# EAGLE design kanal_v2 (EAGLE 6.3)
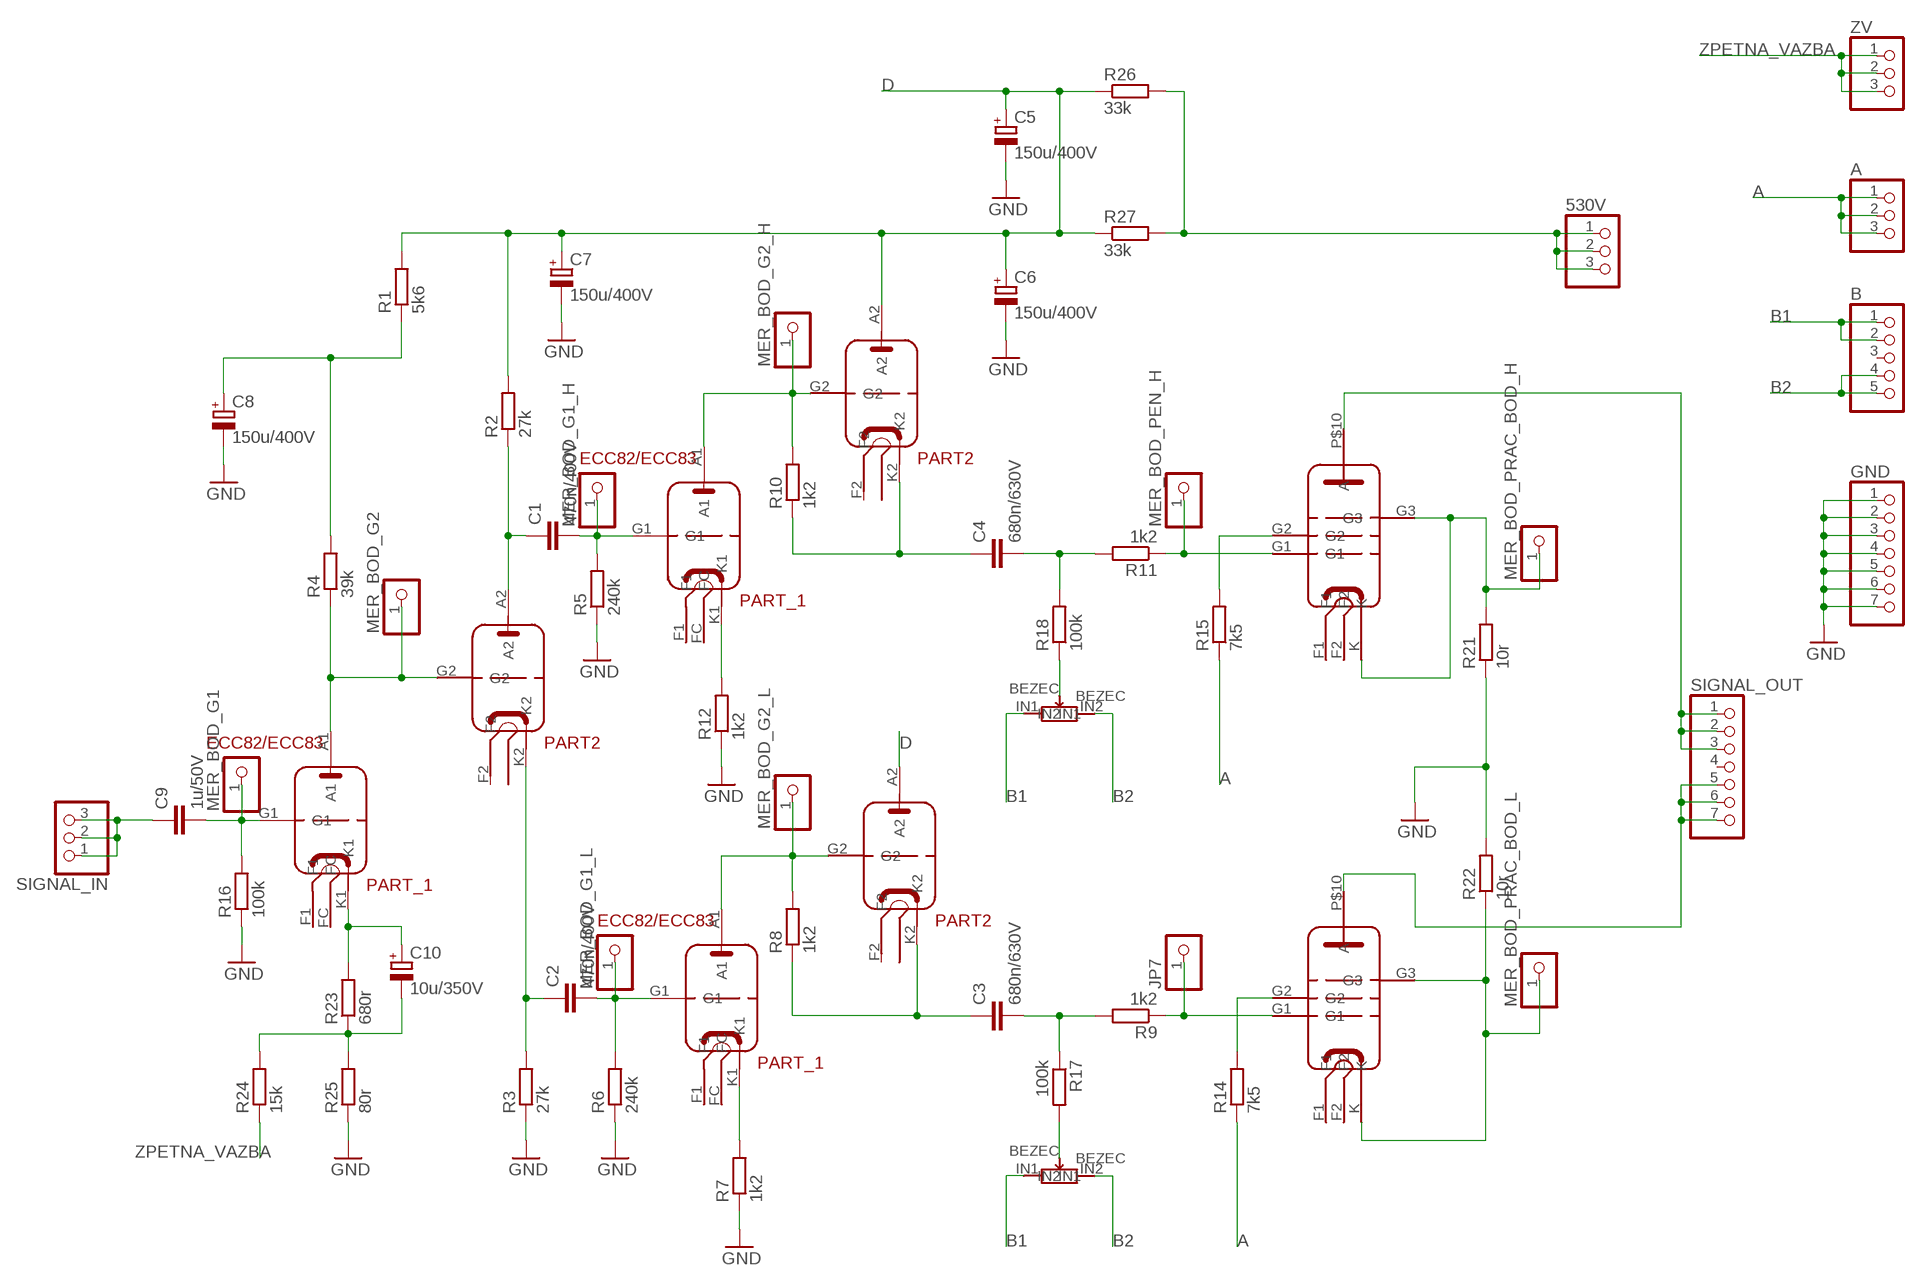
[diagram p0: schematic, sheet 1]

## Parts
530V  PINHD-1X3  [1X03]
A  PINHD-1X3  [1X03]
B  PINHD-1X5  [1X05]
C1  470n/400V  C15/7  [C15B7]
C2  470n/400V  C15/7  [C15B7]
C3  680n/630V  C27/11  [C27.5B11]
C4  680n/630V  C27/11  [C27.5B11]
C5  150u/400V  CPOL-EUE10-25  [EB25D]
C6  150u/400V  CPOL-EUE10-25  [EB25D]
C7  150u/400V  CPOL-EUE10-25  [EB25D]
C8  150u/400V  CPOL-EUE10-25  [EB25D]
C9  1u/50V  C5/3.5  [C5B3.5]
C10  10u/350V  CPOL-EUE5-10.5  [E5-10,5]
GND  PINHD-1X7  [1X07]
JP7  PINHD-1X1  [1X01]
MER_BOD_G1  PINHD-1X1  [1X01]
MER_BOD_G1_H  PINHD-1X1  [1X01]
MER_BOD_G1_L  PINHD-1X1  [1X01]
MER_BOD_G2  PINHD-1X1  [1X01]
MER_BOD_G2_H  PINHD-1X1  [1X01]
MER_BOD_G2_L  PINHD-1X1  [1X01]
MER_BOD_PEN_H  PINHD-1X1  [1X01]
MER_BOD_PRAC_BOD_H  PINHD-1X1  [1X01]
MER_BOD_PRAC_BOD_L  PINHD-1X1  [1X01]
R1  5k6  R-EU_0309/10  [0309/10]
R2  27k  R-EU_0309/10  [0309/10]
R3  27k  R-EU_0309/10  [0309/10]
R4  39k  R-EU_0309/10  [0309/10]
R5  240k  R-EU_0309/10  [0309/10]
R6  240k  R-EU_0309/10  [0309/10]
R7  1k2  R-EU_0309/10  [0309/10]
R8  1k2  R-EU_0309/10  [0309/10]
R9  1k2  R-EU_0309/10  [0309/10]
R10  1k2  R-EU_0309/10  [0309/10]
R11  1k2  R-EU_0309/10  [0309/10]
R12  1k2  R-EU_0309/10  [0309/10]
R14  7k5  R-EU_0309/10  [0309/10]
R15  7k5  R-EU_0309/10  [0309/10]
R16  100k  R-EU_0309/10  [0309/10]
R17  100k  R-EU_0309/10  [0309/10]
R18  100k  R-EU_0309/10  [0309/10]
R21  10r  R-EU_0309/10  [0309/10]
R22  10r  R-EU_0309/10  [0309/10]
R23  680r  R-EU_0309/10  [0309/10]
R24  15k  R-EU_0309/10  [0309/10]
R25  80r  R-EU_0309/10  [0309/10]
R26  33k  R-EU_0309/10  [0309/10]
R27  33k  R-EU_0309/10  [0309/10]
SIGNAL_IN  PINHD-1X3  [1X03]
SIGNAL_OUT  PINHD-1X7  [1X07]
U$1  ECC82  [ECC82_PACKAGE]
U$2  ECC83  [ECC82_PACKAGE]
U$3  ECC83  [ECC82_PACKAGE]
U$4  PL509  [PL509_PACKAGE]
U$5  PL509  [PL509_PACKAGE]
U$6  TRIMMER  [TRIMMER_15X15_PACKAGE]
U$7  TRIMMER  [TRIMMER_15X15_PACKAGE]
ZV  PINHD-1X3  [1X03]

## Nets
A: A.1 A.2 A.3 R14.1 R15.1
B1: B.1 B.2 U$6.IN1 U$7.IN1
B2: B.4 B.5 U$6.IN2 U$7.IN2
D: C5.+ C6.+ C7.+ R1.2 R2.2 R26.1 R27.1 U$2.A2 U$3.A2
GND: C5.- C6.- C7.- C8.- GND.1 GND.2 GND.3 GND.4 GND.5 GND.6 GND.7 R3.1 R5.1 R6.1 R7.1 R12.1 R16.1 R21.1 R22.2 R25.1
MER_BOD_PEN_L: JP7.1 R9.1 U$5.G1
N$1: C9.2 MER_BOD_G1.1 R16.2 U$1.G1
N$2: C10.+ R23.2 U$1.K1
N$3: C10.- R23.1 R24.2 R25.2
N$4: MER_BOD_G2.1 R4.1 U$1.A1 U$1.G2
N$5: C8.+ R1.1 R4.2
N$6: C1.1 R2.1 U$1.A2
N$8: C2.1 R3.2 U$1.K2
N$9: C1.2 MER_BOD_G1_H.1 R5.2 U$2.G1
N$10: C2.2 MER_BOD_G1_L.1 R6.2 U$3.G1
N$11: R17.2 U$6.BEZEC
N$12: R7.2 U$3.K1
N$13: MER_BOD_G2_L.1 R8.2 U$3.A1 U$3.G2
N$14: C3.1 R8.1 U$3.K2
N$15: C3.2 R9.2 R17.1
N$17: R14.2 U$5.G2
N$18: C4.1 R10.1 U$2.K2
N$19: MER_BOD_PRAC_BOD_L.1 R22.1 U$5.G3 U$5.K
N$20: MER_BOD_PRAC_BOD_H.1 R21.2 U$4.G3 U$4.K
N$21: MER_BOD_G2_H.1 R10.2 U$2.A1 U$2.G2
N$22: SIGNAL_OUT.5 SIGNAL_OUT.6 SIGNAL_OUT.7 U$5.P$10(A)
N$23: 530V.1 530V.2 530V.3 R26.2 R27.2
N$24: C4.2 R11.2 R18.2
N$25: MER_BOD_PEN_H.1 R11.1 U$4.G1
N$26: R18.1 U$7.BEZEC
N$27: R12.2 U$2.K1
N$28: C9.1 SIGNAL_IN.1 SIGNAL_IN.2 SIGNAL_IN.3
N$29: R15.2 U$4.G2
N$30: SIGNAL_OUT.1 SIGNAL_OUT.2 SIGNAL_OUT.3 U$4.P$10(A)
ZPETNA_VAZBA: R24.1 ZV.1 ZV.2 ZV.3
Unconnected: B.3 SIGNAL_OUT.4 U$1.F1 U$1.F2 U$1.FC U$2.F1 U$2.F2 U$2.FC U$3.F1 U$3.F2 U$3.FC U$4.F1 U$4.F2 U$5.F1 U$5.F2

## Library data of the parts
530V A SIGNAL_IN ZV = pinhead:PINHD-1X3: PIN HEADER
B = pinhead:PINHD-1X5: PIN HEADER
C1-C4 C9 = capacitor-wima:C: CAPACITOR naming: grid - package width
C5-C8 = resistor:CPOL-EU: POLARIZED CAPACITOR, European symbol
C10 = rcl:CPOL-EU: POLARIZED CAPACITOR, European symbol
GND SIGNAL_OUT = pinhead:PINHD-1X7: PIN HEADER
JP7 MER_BOD_G1 MER_BOD_G1_H MER_BOD_G1_L MER_BOD_G2 MER_BOD_G2_H MER_BOD_G2_L MER_BOD_PEN_H MER_BOD_PRAC_BOD_H MER_BOD_PRAC_BOD_L = pinhead:PINHD-1X1: PIN HEADER
R1-R12 R14-R18 R21-R27 = rcl:R-EU_: RESISTOR, European symbol
U$1 = elektronky:ECC82
U$2 U$3 = elektronky:ECC83
U$4 U$5 = elektronky:PL509
U$6 U$7 = elektronky:TRIMMER

## Board
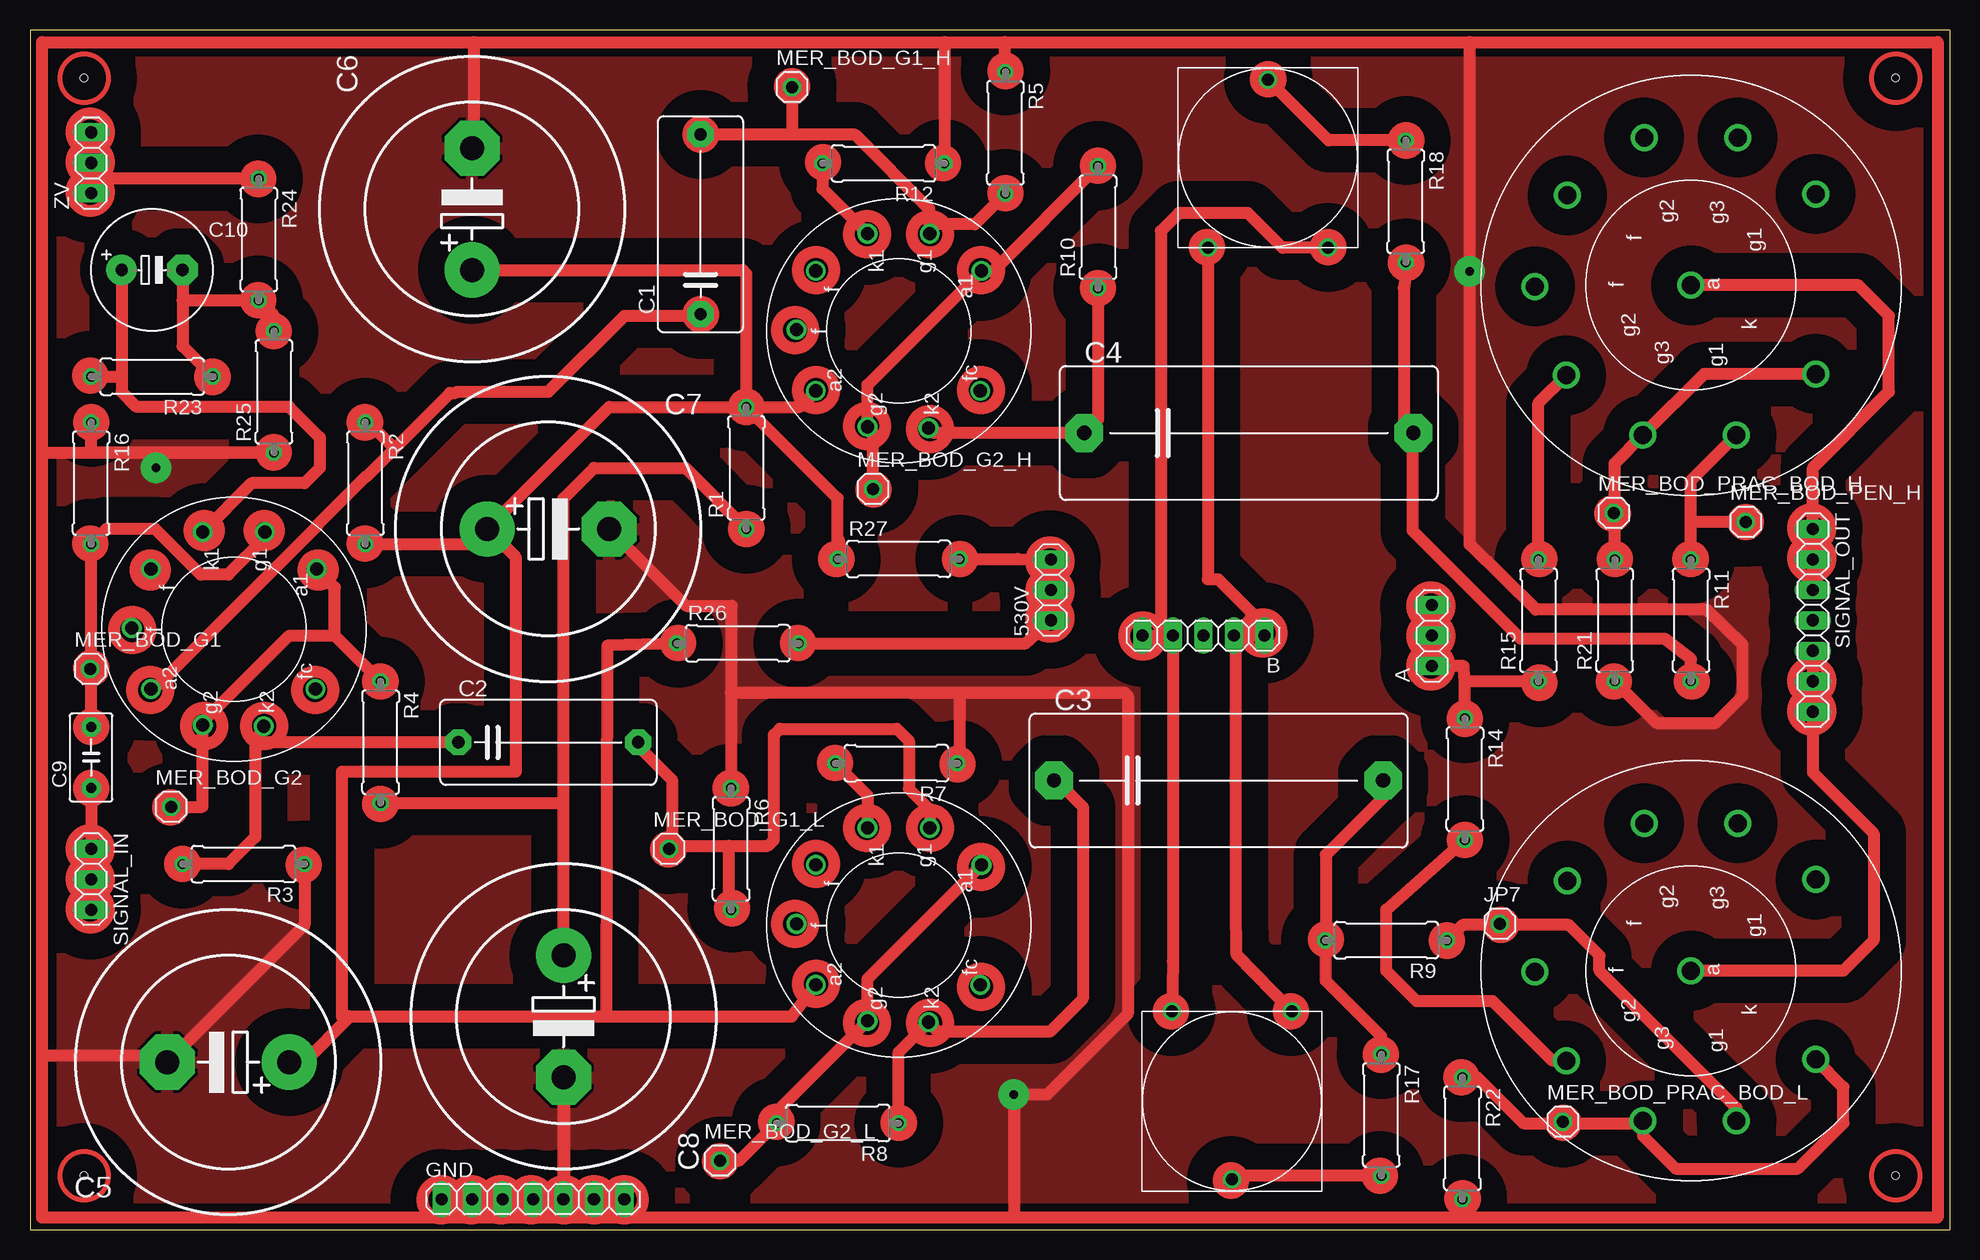
[diagram p1: board, top side]
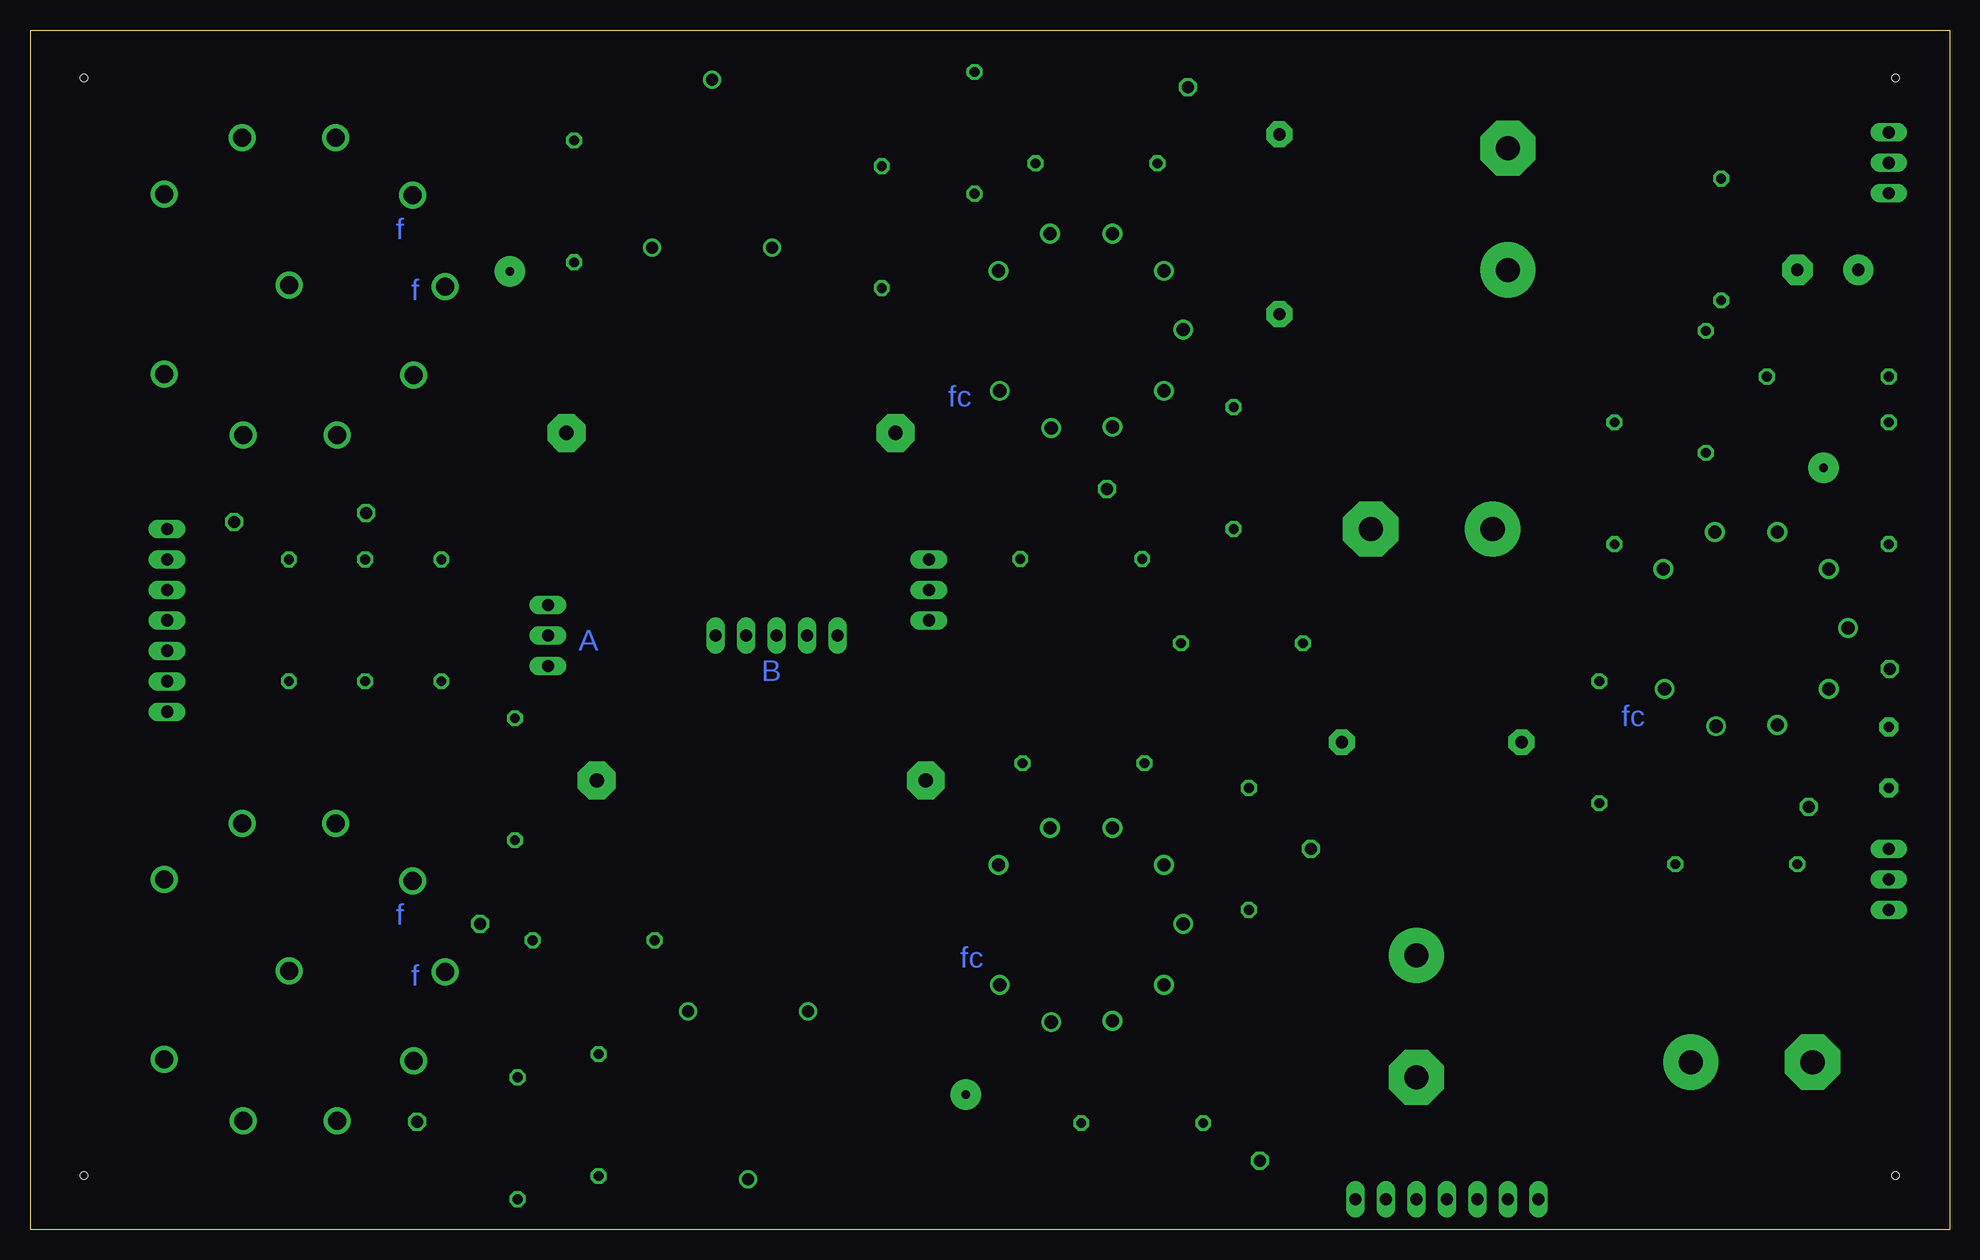
[diagram p2: board, bottom side, seen from below]

Size 160 x 100 mm. Coordinates in mm from the lower left corner, seen from the top.
Outline: 0,0 160,0 160,100 0,100 0,0
Copper layers (1*16): Top 0.035mm / dielectric 1.5mm / Bottom 0.035mm
Design rules "default": minimum track width 10mil, minimum drill 24mil, track to track 8mil, track to pad 8mil, pad to pad 8mil, via to via 8mil, smd to smd 8mil, copper to edge 40mil, drill to drill 8mil, minimum pad ring 10mil, minimum via ring 8mil, stop-mask expansion 4mil, vias tented up to drill 0mil, thermal gap 10mil
Holes 0.6 mm at 4.5,4.5 4.5,96 155.5,96 155.5,4.5

### Footprints (pad centres in the part's own frame; a part is rotated, then mirrored left to right if it is on the bottom)
1X03 = drill 1.016 long: 1 -2.54,0; 2 0,0; 3 2.54,0
1X05 = drill 1.016 long: 1 -5.08,0; 2 -2.54,0; 3 0,0; 4 2.54,0; 5 5.08,0
C15B7 = drill 1.016 pad 2.159 octagon: 1 -7.493,0; 2 7.493,0
C27.5B11 = drill 1.194 pad 3.15 octagon: 1 -13.716,0; 2 13.716,0
EB25D = drill 2.007 pad 4.597: + -5.08,0 | drill 2.007 pad 4.597 octagon: - 5.08,0
C5B3.5 = drill 0.813 pad 1.6 octagon: 1 -2.54,0; 2 2.54,0
E5-10,5 = drill 1.016 pad 2.54: + -2.54,0 | drill 1.016 pad 2.54 octagon: - 2.54,0
1X07 = drill 1.016 long: 1 -7.62,0; 2 -5.08,0; 3 -2.54,0; 4 0,0; 5 2.54,0; 6 5.08,0; 7 7.62,0
1X01 = drill 1.016 octagon: 1 0,0
0309/10 = drill 0.813 octagon: 1 -5.08,0; 2 5.08,0
ECC82_PACKAGE = drill 1.1: A1 -5,6.9; A2 5,-6.9; F1 -5,-6.9; F2 -0.1,-8.5; FC 5,6.8; G1 -8.1,2.6; G2 8,-2.6; K1 -8.1,-2.6; K2 8.1,2.5
PL509_PACKAGE = drill 1.5: F1 -0.1,13; F2 7.5,10.3; G1 -12.5,-3.8; G2 -7.5,10.4; G3 -12.5,4; G_1 7.6,-10.4; G_2 12.3,3.9; G_3 12.3,-3.9; K -7.4,-10.4; P$10 0,0
TRIMMER_15X15_PACKAGE = drill 1: BEZEC 7.5,14; IN1 2.5,0; IN2 12.5,0

### Placement (x,y rotation side)
530V  85.09,53.34 90 top
A  116.84,49.53 90 top
B  97.79,49.53 180 top
C1  55.88,83.82 90 top
C2  43.18,40.64 0 top
C3  99.06,37.45 0 top
C4  101.58,66.42 0 top
C5  16.51,13.97 180 top
C6  36.83,85.09 90 top
C7  43.18,58.42 0 top
C8  44.45,17.78 270 top
C9  5.08,39.37 90 top
C10  10.16,80.01 0 top
GND  41.91,2.54 0 top
JP7  122.5,25.5 0 top
MER_BOD_G1  5,46.75 0 top
MER_BOD_G1_H  63.5,95.25 0 top
MER_BOD_G1_L  53.25,31.75 0 top
MER_BOD_G2  11.75,35.25 0 top
MER_BOD_G2_H  70.25,61.75 0 top
MER_BOD_G2_L  57.5,5.75 0 top
MER_BOD_PEN_H  143,59 0 top
MER_BOD_PRAC_BOD_H  132,59.75 0 top
MER_BOD_PRAC_BOD_L  127.75,9 0 top
R1  59.69,63.5 90 top
R2  27.94,62.23 270 top
R3  17.78,30.48 180 top
R4  29.21,40.64 270 top
R5  81.28,91.44 270 top
R6  58.42,31.75 270 top
R7  72.2,38.89 180 top
R8  67.31,8.89 180 top
R9  113.03,24.13 180 top
R10  89.01,83.58 90 top
R11  138.43,50.8 270 top
R12  71.12,88.9 180 top
R14  119.59,37.56 270 top
R15  125.73,50.8 90 top
R16  5.08,62.23 270 top
R17  112.62,9.56 270 top
R18  114.66,85.73 270 top
R21  132.08,50.8 90 top
R22  119.38,7.62 270 top
R23  10.16,71.12 180 top
R24  19.05,82.55 270 top
R25  20.32,69.85 90 top
R26  58.99,48.89 0 top
R27  72.39,55.92 0 top
SIGNAL_IN  5.08,29.21 270 top
SIGNAL_OUT  148.59,50.8 270 top
U$1  16.97,50.07 270 top
U$2  72.39,74.93 270 top
U$3  72.39,25.4 270 top
U$4  138.43,78.74 90 top
U$5  138.43,21.59 90 top
U$6  107.66,18.2 180 top
U$7  95.67,81.86 0 top
ZV  5.08,88.94 90 top

### Tracks (layer width: path | path; a pad name or v marks a point on that pad's centre or on a via)
A
  Top 1.016: R14.1 119.59,45.72 | 119.59,45.72 119.5,46.75 119.5,46.99 A.1 A.2 A.3 | R15.1 119.59,45.72
B1
  Top 1.016: U$7.IN1 98.17,54.23 99.02,54.23 101.75,51.5 101.75,49.78 101.5,49.53 | 101.5,49.53 B.2 100.5,49.36 100.5,27 100.55,22.95 U$6.IN1 | 101.5,49.53 B.1
B2
  Top 1.016: U$7.IN2 104.39,81.86 101.5,84.75 95.75,84.75 94.25,83.25 94.25,49.75 94.5,49.5 | 94.5,49.5 92.74,49.5 B.5 92.91,49.33 95.17,49.33 95.25,49.25 95.25,22.36 U$6.IN2 | B.4 94.53,49.53 94.5,49.5
D
  Top 1.016: C5.+ 22.86,13.97 26.67,17.78 | 26.67,17.78 48,17.78 | 48,17.78 63.47,17.78 U$3.A2 | C6.+ 59.38,80.01 59.69,79.7 R1.2 | C7.+ 48.26,68.58 R1.2 | R1.2 67.31,60.96 R27.1 67.42,57.53 | R2.2 36.83,57.15 C7.+ | R1.2 64.14,68.58 U$2.A2 | 26.67,17.78 26,17.78 26,38.2 40.5,38.2 40.5,56.02 C7.+ | R26.1 48.1,48.69 48,17.78
GND  (via drill 0.7 pad 2.54)
  Top 0.254: C6.-
  Top 1.016: R3.1 22.86,25.4 C5.- 10.9,14.5 1,14.5 | R16.1 5.08,64.77 R25.1 20.3,64.75 10.75,64.75 | GND.7 GND.6 GND.5 | GND.5 GND.4 GND.3 GND.2 GND.1 | GND.5 C8.- 44.5,12.65 44.5,1 | R21.1 135.55,42.25 140.5,42.25 142.75,44.5 142.75,48.75 139.7,51.7 125.5,51.7 120,57.1 v120,79.9 120,99 | 37,99 1,99 1,64.75 | 37,99 76.25,99 | 76.25,99 81.25,99 | 81.25,99 120,99 | 120,99 159,99 159,1 119.5,1 | 119.5,1 82,1 | 82,1 44.5,1 | 44.5,1 1,1 1,14.5 | 1,14.5 1,64.75 | C6.- 37,90.34 37,99 | R12.1 76.25,88.95 76.25,99 | 10.75,64.75 1,64.75 | R5.1 81,96.8 81.25,97.05 81.25,99 | R22.2 119.5,2.42 119.5,1 | 82,1 v82,11.25 84.75,11.25 91.5,18 91.5,44.5 91.25,44.75 77.5,44.75 | C7.- 54.68,52 58.5,52 58.42,51.92 58.42,44.75 | 58.42,44.75 R6.1 | 77.5,44.75 58.42,44.75 | 77,39.17 R7.1 77.5,39.11 77.5,44.75 | v10.5,63.5 10.75,63.5 10.75,64.75
  pour Top (isolate 2.184, rank 6): 1,99 159,99 159,1 1,1
MER_BOD_PEN_L
  Top 0.254: 123.19,25.4 JP7.1
  Top 1.016: U$5.G1 142.23,10.17 130.81,21.59 130.81,22.86 128.27,25.4 123.19,25.4 119.38,25.4 R9.1
N$1
  Top 0.406: MER_BOD_G1.1 5.08,46.75 C9.2
  Top 1.016: C9.2 R16.2 6.35,58.42 10.41,58.42 14.22,54.61 16.51,54.61 19.57,57.67 U$1.G1
N$2
  Top 1.016: C10.+ 7.62,71.12 | 7.62,71.12 7.62,69.85 8.89,68.58 21.59,68.58 24.13,66.04 24.13,63.5 22.86,62.23 18.43,62.23 U$1.K1 | R23.2 7.62,71.12
N$3
  Top 1.016: C10.- 12.7,77.47 | 12.7,77.47 12.7,73.66 R23.1 | 12.7,77.47 R24.2 20.32,76.2 R25.2
N$4
  Top 1.016: R4.1 25.4,49.53 | 25.4,49.53 25.4,53.54 U$1.A1 | 25.4,49.53 21.59,49.53 14.37,42.31 U$1.G2 14.37,35.25 MER_BOD_G2.1
N$5
  Top 1.016: C8.+ 44.45,35.5 | 44.45,35.5 44.45,60.96 46.99,63.5 54.61,63.5 R1.1 | R4.2 44.39,35.56 44.45,35.5
N$6
  Top 1.016: C1.1 55.75,76.2 49.53,76.2 43.18,69.85 35.56,69.85 35.46,69.75 35,69.75 30.38,65.12 | U$1.A2 10.32,45.07 24,58.75 24,58.81 27.94,62.75 28,62.75 30.38,65.12 | R2.1 28.19,67.31 30.38,65.12
N$8
  Top 1.016: U$1.K2 18.77,40.64 | 18.77,40.64 18.77,32.74 16.51,30.48 R3.2 | C2.1 18.77,40.64
N$9
  Top 1.016: C1.2 63.5,91.31 | 63.5,91.31 68.71,91.31 74.93,85.09 74.93,83.82 | 74.93,83.82 74.93,83.09 U$2.G1 | R5.2 78.74,83.82 74.93,83.82 | MER_BOD_G1_H.1 63.5,91.31
N$10
  Top 0.254: MER_BOD_G1_L.1 53.34,31.75 53.5,31.59
  Top 1.016: C2.2 50.67,40.33 53.5,37.5 53.5,31.59 53.91,32 58.25,32 | R6.2 58.67,26.67 58.25,27.09 58.25,32 | U$3.G1 74.99,35.01 73.25,36.75 73.25,40.75 72.25,41.75 62.5,41.75 62,41.25 62,32.5 61.5,32 58.25,32
N$11
  Top 1.016: R17.2 100.44,4.48 U$6.BEZEC
N$12
  Top 1.016: R7.2 69.79,36.22 U$3.K1
N$13
  Top 1.016: U$3.A1 69.86,20.97 arc45 69.79,20.8 U$3.G2 62.3,9.91 arc45 62.23,9.73 R8.2 59.09,5.75 MER_BOD_G2_L.1
N$14
  Top 1.016: R8.1 72.39,14.8 U$3.K2 75.69,16.5 85,16.5 87.75,19.25 87.75,35.25 85.55,37.45 C3.1
N$15
  Top 1.016: C3.2 112.78,36.03 108,31.25 108,24.18 R9.2 108,24.08 108,20.75 112.62,16.13 R17.1
N$17
  Top 1.016: U$5.G2 126.88,14.09 121.92,19.05 115.57,19.05 113.03,21.59 113.03,26.67 R14.2
N$18
  Top 1.016: R10.1 89.01,67.57 C4.1 75.3,66.42 U$2.K2
N$19
  Top 1.016: R22.1 120.65,12.7 124.46,8.89 127.86,8.89 | 127.86,8.89 134.23,8.89 U$5.G3 134.43,7.81 137.16,5.08 147.32,5.08 151.13,8.89 151.13,11.89 U$5.K | MER_BOD_PRAC_BOD_L.1 127.86,8.89
N$20
  Top 1.016: R21.2 132.08,59.75 | 132.08,59.75 132.08,63.89 U$4.G3 139.53,71.34 U$4.K | MER_BOD_PRAC_BOD_H.1 132.08,59.75
N$21
  Top 1.016: R10.2 80.28,79.93 U$2.A1 69.79,70.43 U$2.G2 70.25,66.47 MER_BOD_G2_H.1
N$22
  Top 1.016: SIGNAL_OUT.5 SIGNAL_OUT.6 SIGNAL_OUT.7 148.59,38.1 153.67,33.02 153.67,24.13 151.13,21.59 U$5.P$10
N$23
  Top 1.016: R26.2 82.98,48.89 530V.1 530V.2 530V.3 82.3,55.92 R27.2 77.83,55.78
N$24
  Top 1.016: R18.2 114.66,79.66 114.5,78.5 114.5,67.22 C4.2 115.25,66.37 115.25,58.25 124.25,49.25 136.25,49.25 138.43,47.57 R11.2
N$25
  Top 1.016: R11.1 138.43,59 | 138.43,59 138.43,62.44 U$4.G1 | MER_BOD_PEN_H.1 138.43,59
N$26
  Top 1.016: R18.1 108.22,90.81 U$7.BEZEC
N$27
  Top 1.016: R12.2 66.04,86.78 U$2.K1
N$28
  Top 1.016: C9.1 SIGNAL_IN.1 SIGNAL_IN.2 SIGNAL_IN.3
N$29
  Top 1.016: R15.2 125.73,68.94 U$4.G2
N$30
  Top 1.016: SIGNAL_OUT.3 SIGNAL_OUT.2 SIGNAL_OUT.1 148.59,63.5 154.94,69.85 154.94,76.2 152.4,78.74 U$4.P$10
ZPETNA_VAZBA
  Top 0.406: 5.21,87.63 arc90 5.08,87.5
  Top 1.016: ZV.1 5.08,87.5 ZV.2 ZV.3 | R24.1 5.21,87.63
(copper drawn outside any net)
  shapes: Top circle x124

### Text on the board
Bottom: f | f | fc | A | B | fc | f | fc | f